# Altium schematic sheet Sheet1.SchDoc
size 297 x 209 mm; SheetNumber: 1; SheetTotal: 1
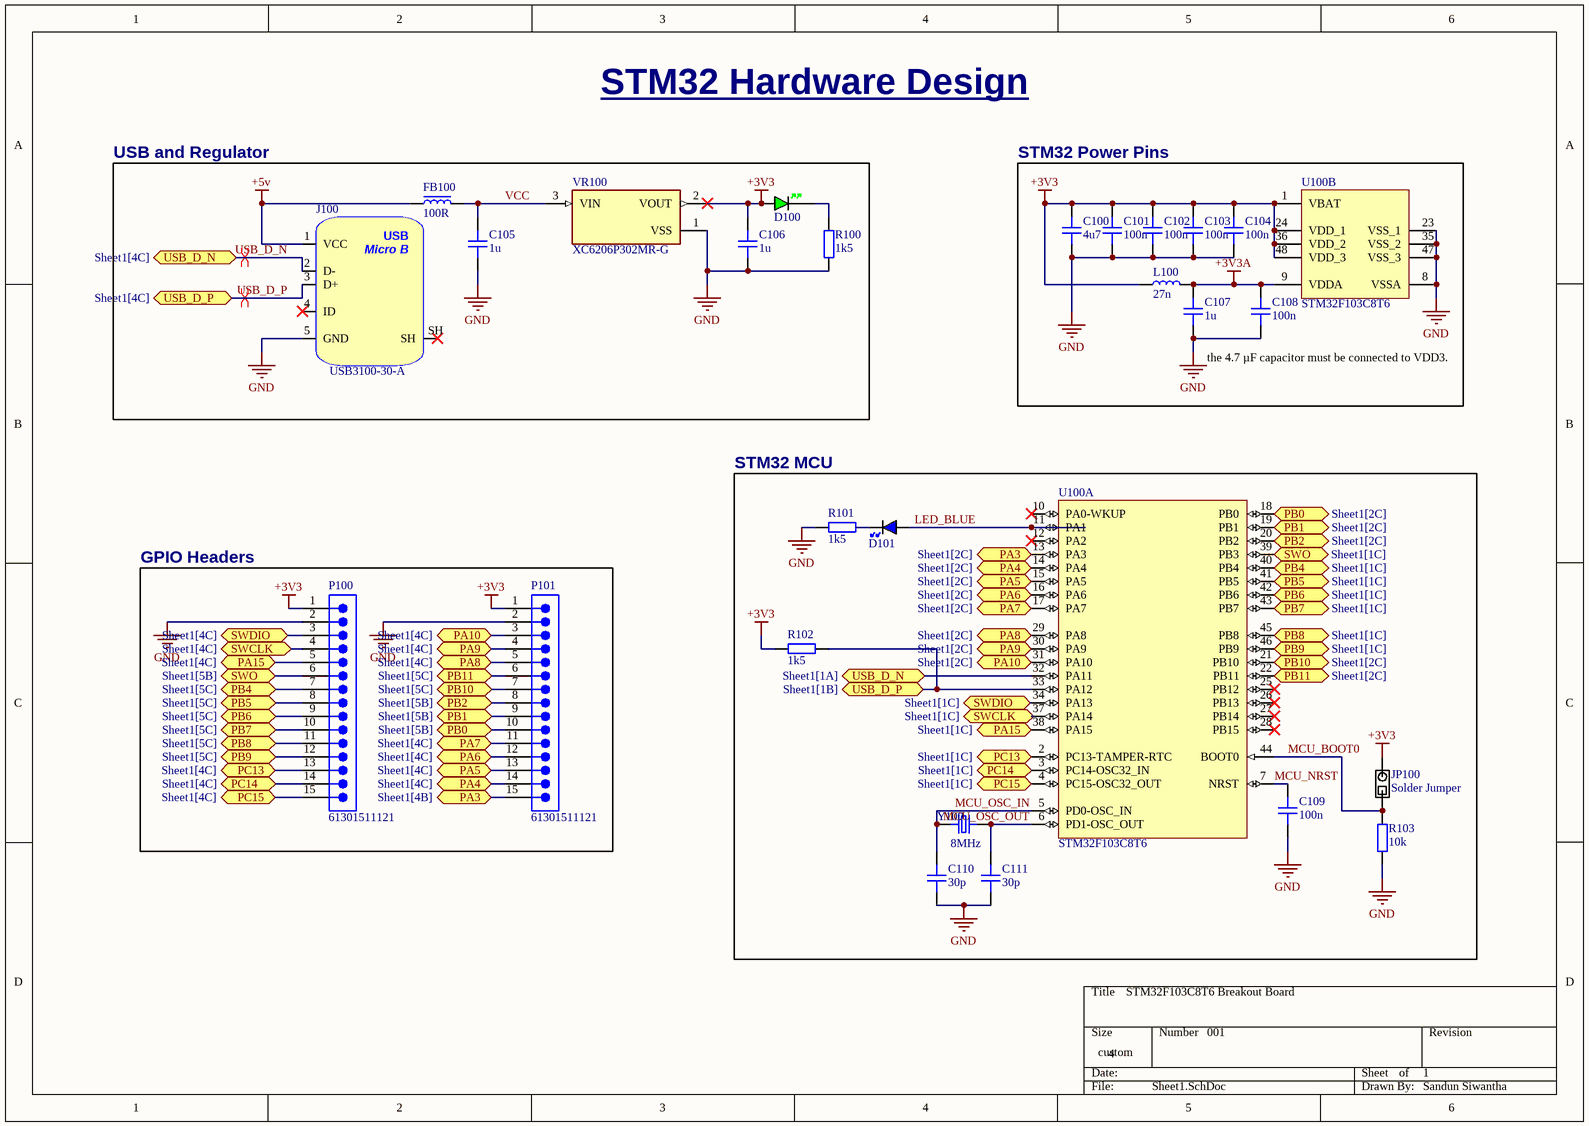
[diagram p0: Sheet1.SchDoc]

## Parts
C100  4u7  [CAP_0603]
C101  100n  [CAP_0603]
C102  100n  [CAP_0603]
C103  100n  [CAP_0603]
C104  100n  [CAP_0603]
C105  1u  [CAP_0805]
C106  1u  [CAP_0805]
C107  1u  [CAP_0603]
C108  100n  [CAP_0603]
C109  100n  [CAP_0603]
C110  30p  [CAP_0603]
C111  30p  [CAP_0603]
D100  GREEN  [LED_0805_GREEN]  (value not drawn)
D101  BLUE  [LED_0603_BLUE]  (value not drawn)
FB100  100R  [FB_0805]
J100  USB3100-30-A  [USB3100-30-A]
JP100  Solder Jumper  [SolderJumper_Single]
L100  27n  [IND_0603]
P100  61301511121  [61301511121]
P101  61301511121  [61301511121]
R100  1k5  [RES_0805]
R101  1k5  [RES_0603]
R102  1k5  [RES_0603]
R103  10k  [RES_0603]
U100  STM32F103C8T6  [STM-LQFP48_L]  (parts A,B of 2)
VR100  XC6206P302MR-G  [SOT95P280X130-3N]
Y100  8MHz  [XTAL_ECS-.327-9-34B-TR]

## Blocks framed on the sheet
USB and Regulator: C105 C106 D100 FB100 J100 R100 VR100
STM32 Power Pins: C100-C104 C107 C108 L100 U100
STM32 MCU: C109-C111 D101 JP100 R101-R103 U100 Y100
GPIO Headers: P100 P101

## Ports
PA3 (bidir, see Sheet1[2C]), PA3 (bidir, see Sheet1[4B]), PA4 (bidir, see Sheet1[2C]), PA4 (bidir, see Sheet1[4C]), PA5 (bidir, see Sheet1[2C]), PA5 (bidir, see Sheet1[4C]), PA6 (bidir, see Sheet1[2C]), PA6 (bidir, see Sheet1[4C]), PA7 (bidir, see Sheet1[2C]), PA7 (bidir, see Sheet1[4C]), PA8 (bidir, see Sheet1[2C]), PA8 (bidir, see Sheet1[4C]), PA9 (bidir, see Sheet1[2C]), PA9 (bidir, see Sheet1[4C]), PA10 (bidir, see Sheet1[2C]), PA10 (bidir, see Sheet1[4C]), PA15 (bidir, see Sheet1[1C]), PA15 (bidir, see Sheet1[4C]), PB0 (bidir, see Sheet1[2C]), PB0 (bidir, see Sheet1[5B]), PB1 (bidir, see Sheet1[2C]), PB1 (bidir, see Sheet1[5B]), PB2 (bidir, see Sheet1[2C]), PB2 (bidir, see Sheet1[5B]), PB4 (bidir, see Sheet1[1C]), PB4 (bidir, see Sheet1[5C]), PB5 (bidir, see Sheet1[1C]), PB5 (bidir, see Sheet1[5C]), PB6 (bidir, see Sheet1[1C]), PB6 (bidir, see Sheet1[5C]), PB7 (bidir, see Sheet1[1C]), PB7 (bidir, see Sheet1[5C]), PB8 (bidir, see Sheet1[1C]), PB8 (bidir, see Sheet1[5C]), PB9 (bidir, see Sheet1[1C]), PB9 (bidir, see Sheet1[5C]), PB10 (bidir, see Sheet1[2C]), PB10 (bidir, see Sheet1[5C]), PB11 (bidir, see Sheet1[2C]), PB11 (bidir, see Sheet1[5C]), PC13 (bidir, see Sheet1[1C]), PC13 (bidir, see Sheet1[4C]), PC14 (bidir, see Sheet1[1C]), PC14 (bidir, see Sheet1[4C]), PC15 (bidir, see Sheet1[1C]), PC15 (bidir, see Sheet1[4C]), SWCLK (bidir, see Sheet1[1C]), SWCLK (bidir, see Sheet1[4C]), SWDIO (bidir, see Sheet1[1C]), SWDIO (bidir, see Sheet1[4C]), SWO (bidir, see Sheet1[1C]), SWO (bidir, see Sheet1[5B]), USB_D_N (bidir, see Sheet1[1A]), USB_D_N (bidir, see Sheet1[4C]), USB_D_P (bidir, see Sheet1[1B]), USB_D_P (bidir, see Sheet1[4C])

## Nets
+3V3: C100.2 C101.2 C102.2 C103.2 C104.2 C106.2 D100.A JP100.2 L100.1 P100.1 P101.1 R102.2 U100.1(VBAT) U100.24(VDD_1) U100.36(VDD_2) U100.48(VDD_3) VR100.2(VOUT)
+3V3A: C107.2 C108.2 L100.2 U100.9(VDDA)
+5v: FB100.1 J100.1(VCC)
GND: C100.1 C101.1 C102.1 C103.1 C104.1 C105.1 C106.1 C107.1 C108.1 C109.1 C110.1 C111.1 J100.5(GND) P100.2 P101.2 R100.2 R101.1 R103.1 U100.8(VSSA) U100.23(VSS_1) U100.35(VSS_2) U100.47(VSS_3) VR100.1(VSS)
LED_BLUE: D101.A U100.11(PA1)
MCU_BOOT0: JP100.1 R103.2 U100.44(BOOT0)
MCU_NRST: C109.2 U100.7(NRST)
MCU_OSC_IN: C110.2 U100.5(PD0-OSC_IN) Y100.1
MCU_OSC_OUT: C111.2 U100.6(PD1-OSC_OUT) Y100.2
PA3: P101.15 U100.13(PA3) ; port PA3
PA4: P101.14 U100.14(PA4) ; port PA4
PA5: P101.13 U100.15(PA5) ; port PA5
PA6: P101.12 U100.16(PA6) ; port PA6
PA7: P101.11 U100.17(PA7) ; port PA7
PA8: P101.5 U100.29(PA8) ; port PA8
PA9: P101.4 U100.30(PA9) ; port PA9
PA10: P101.3 U100.31(PA10) ; port PA10
PA15: P100.5 U100.38(PA15) ; port PA15
PB0: P101.10 U100.18(PB0) ; port PB0
PB1: P101.9 U100.19(PB1) ; port PB1
PB2: P101.8 U100.20(PB2) ; port PB2
PB4: P100.7 U100.40(PB4) ; port PB4
PB5: P100.8 U100.41(PB5) ; port PB5
PB6: P100.9 U100.42(PB6) ; port PB6
PB7: P100.10 U100.43(PB7) ; port PB7
PB8: P100.11 U100.45(PB8) ; port PB8
PB9: P100.12 U100.46(PB9) ; port PB9
PB10: P101.7 U100.21(PB10) ; port PB10
PB11: P101.6 U100.22(PB11) ; port PB11
PC13: P100.13 U100.2(PC13-TAMPER-RTC) ; port PC13
PC14: P100.14 U100.3(PC14-OSC32_IN) ; port PC14
PC15: P100.15 U100.4(PC15-OSC32_OUT) ; port PC15
SWCLK: P100.4 U100.37(PA14) ; port SWCLK
SWDIO: P100.3 U100.34(PA13) ; port SWDIO
SWO: P100.6 U100.39(PB3) ; port SWO
USB_D_N: J100.2(D-) U100.32(PA11) ; port USB_D_N
USB_D_P: J100.3(D+) R102.1 U100.33(PA12) ; port USB_D_P
VCC: C105.2 FB100.2 VR100.3(VIN)
NetD100_K: D100.K R100.1
NetD101_K: D101.K R101.2

Not connected (* = marked no-connect by the designer): J100 4(ID)* SH*; U100 10(PA0-WKUP)* 12(PA2)* 25(PB12)* 26(PB13)* 27(PB14)* 28(PB15)*

## Layout directives
differential pair: USB_D_N, USB_D_P

## Notes on the sheet
- STM32 Hardware Design
- the 4.7 µF capacitor must be connected to VDD3.
- STM32F103C8T6 Breakout Board <https://github.com/Sandun-S/STM32F1_BreakoutBoard>
- 4
- 001
- 1
- Sandun Siwantha
- (in symbol USB3100-30-A) USB; Micro B

## Library data of the parts
C100-C104 C107-C111 = CAP_0603: Capacitor SMD 0603; Manufacturer: *; Manufacturer Part Number: *; Distributor Link: *; LCSC: *; Rating: *; Dielectric: *
C105 C106 = CAP_0805: Capacitor SMD 0805; Manufacturer: *; Manufacturer Part Number: *; Distributor Link: *; LCSC: *; Rating: *; Dielectric: *
D100 = LED_0805_GREEN: LED 0805 GREEN SMD; Manufacturer: *; Manufacturer Part Number: *; Distributor Link: *; LCSC: *
D101 = LED_0603_BLUE: LED 0603 BLUE SMD
FB100 = FB_0805: Ferrite Bead SMD 0805; Manufacturer: *; Manufacturer Part Number: *; Distributor Link: *; LCSC: *
J100 = USB3100-30-A: USB Connector Type Micro B 2.0 SMD Reverse Mount; Manufacturer: GCT; Manufacturer Part Number: USB3100-30-A
JP100 = SolderJumper_Single: Solder Jumper Single 0.5mm Pitch
L100 = IND_0603: Inductor SMD 0603
P100 P101 = CMP-207987-000006-3: CONN HEADER VERT 15POS 2.54MM; NexarPartId: 32855546; Number of Contacts: 15; Gender: Male; Connector Type: Male Pin; Voltage Rating: 250V; Current Rating: 3A; Min Operating Temperature: -40°C; Pitch: 2.54mm; Contact Mating Length: 5.9944mm; Number of Positions: 15; REACH SVHC: Unknown; Color: Black; Termination: Solder; Contact Plating: Gold; Height: 8.89mm; Number of Rows: 1; RoHS: Compliant; Packaging: Bulk; Mount: Through Hole; Contact Material: Copper; Max Operating Temperature: 105°C
R100 = RES_0805: Resistor SMD 0805; Manufacturer: *; Manufacturer Part Number: *; Distributor Link: *; LCSC: *
R101-R103 = RES_0603: Resistor SMD 0603; Manufacturer: *; Manufacturer Part Number: *; Distributor Link: *; LCSC: *
U100 = CMP-0237-00215-3: ARM Cortex-M3 32-bit MCU, 64 KB Flash, 20 KB Internal RAM, 37 I/Os, 48-pin LQFP, -40 to 85 degC, Tray; Supply Voltage(Vcc) min (V): 2; Internal RAM Size (kB): 20; FLASH Size (Prog) (kB): 64; A/D Converter: 2x12-bit (10 Channel); I/Os (High Current): 37; Operating Frequency(F) (Processor speed) (MHz): 72; Core: ARM Cortex-M3; ComponentLink3Description: Package Specification; Mounting Technology: Surface Mount; PartNumber: STM32F103C8T6; PackageReference: LQFP48; Packing: Tray; ComponentLink3URL: http://www.st.com/st-web-ui/static/active/en/resource/technical/document/datasheet/DM00058181.pdf; DatasheetVersion: Rev. 16; ComponentLink1URL: http://www.st.com/web/en/home.html; PackageVersion: Rev. 6, 06/2013; ComponentLink2URL: http://www.st.com/st-web-ui/static/active/en/resource/technical/document/datasheet/CD00161566.pdf; ComponentLink1Description: Manufacturer URL; ComponentLink2Description: Datasheet; PackageDescription: 48-Pin Low Profile Quad Flat Package, 7 x 7 mm Body, 0.5 mm Pitch
VR100 = XC6206P302MR-G: Linear Voltage Regulator IC Positive Fixed 1 Output 200mA SOT-23; MF: Torex Semiconductor Ltd; SnapEDA_Link: https://www.snapeda.com/parts/XC6206P302MR-G/Torex/view-part/?ref=snap; Package: None; Value: *; MP: XC6206P302MR-G; Check_prices: https://www.snapeda.com/parts/XC6206P302MR-G/Torex/view-part/?ref=eda
Y100 = ECS-.327-9-34B-TR: 32.768 kHz Â±20ppm Crystal 9pF 70 kOhms 2-SMD, No Lead; MF: ECS Inc.; SnapEDA_Link: https://www.snapeda.com/parts/ECS-.327-9-34B-TR/ECS/view-part/?ref=snap; Package: ECX-31B-34B-2 ECS; Value: *; MP: ECS-.327-9-34B-TR; Check_prices: https://www.snapeda.com/parts/ECS-.327-9-34B-TR/ECS/view-part/?ref=eda